# EAGLE design IoT_Shield_V1 (EAGLE 7.6.0)

## Sheet 1 of 2
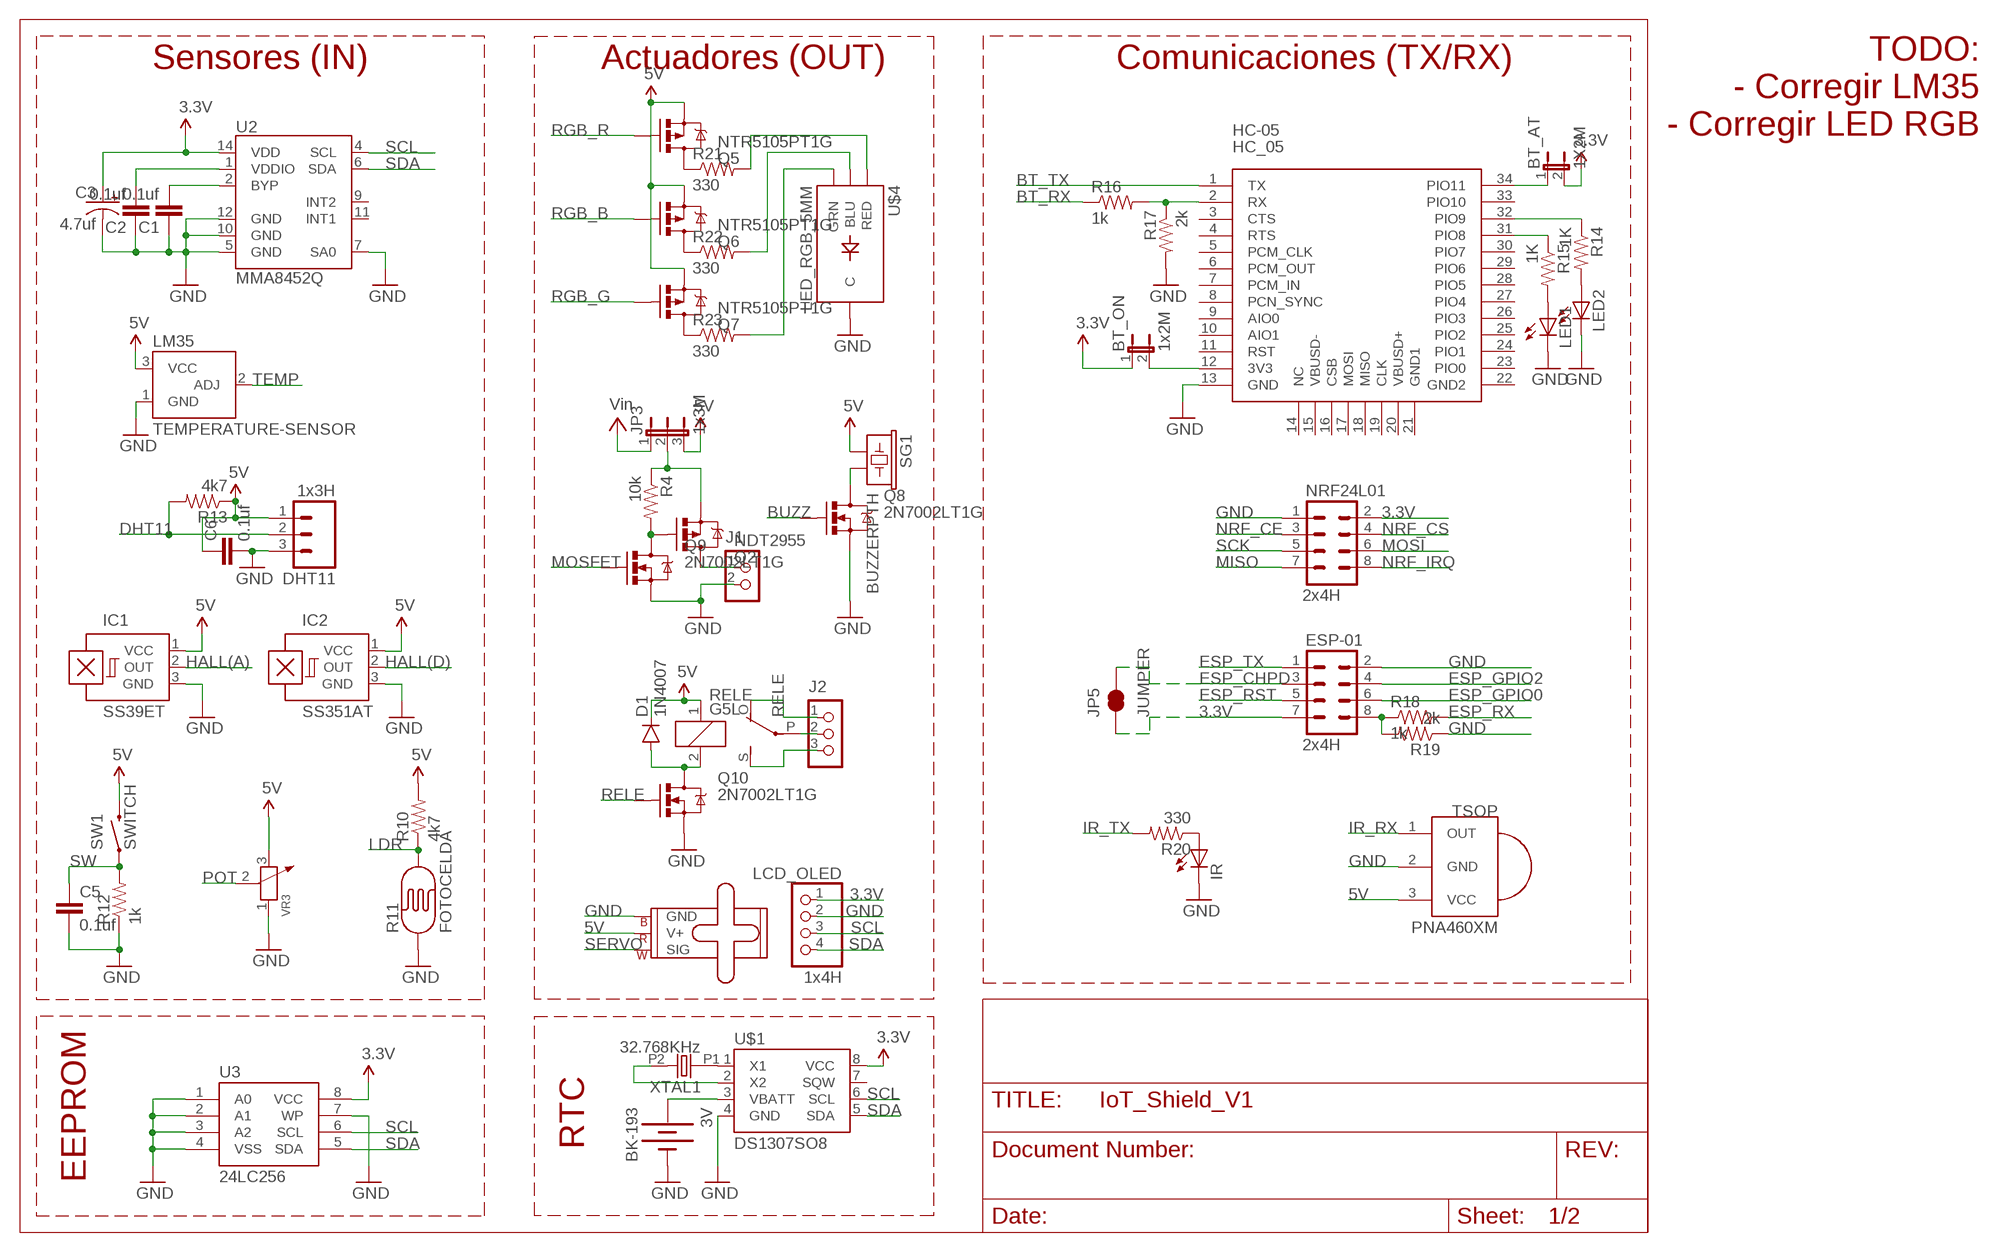
[diagram p0: schematic, sheet 1]

### Parts
3V  BK-193  [BATTERY-20MMTH]
BT_AT  1X2M  JP1E  [JP1]
BT_ON  1x2M  JP1E  [JP1]
C1  0.1uf  CAP0805  [0805]
C2  0.1uf  CAP0805  [0805]
C3  4.7uf  CAP_POL3528-KIT  [EIA3528-KIT]
C5  0.1uf  CAP0805  [0805]
C6  0.1uf  CAP0805  [0805]
D1  1N4007  DIODESMA  [SMA-DIODE]
DHT11  1x3H  M03LOCK  [1X03_LOCK]
ESP-01  2x4H  M04X2  [2X4]
HC-05  HC_05  [BLUETOOTH_SMD]
IC1  SS39ET  A1202LH  [SOT23-W]
IC2  SS351AT  A1202LH  [SOT23-W]
IR  LEDIRL80A  [IRL80A]
J1  CON_TERMINAL_BLOCK_02-5MM  [TERMINAL_BLOCK_2P_5]
J2  CON_TERMINAL_BLOCK_03-5MM  [TERMINAL_BLOCK_3P_5]
JP3  1x3M  JP2E  [JP2]
JP5  JUMPER  JUMPER-PAD-2-NC_BY_TRACENO_SILK  [PAD-JUMPER-2-NC_BY_TRACE_NO_SILK]
LCD_OLED  1x4H  PINHD-1X4  [1X04]
LED1  LEDCHIPLED_0805  [CHIPLED_0805]
LED2  LEDCHIPLED_0805  [CHIPLED_0805]
LM35  TEMPERATURE-SENSOR  [TO-92]
NRF24L01  2x4H  M04X2  [2X4]
Q2  NDT2955  [SOT223]
Q5  NTR5105PT1G  MOSFET-PCHANNEL  [SOT23-3]
Q6  NTR5105PT1G  MOSFET-PCHANNEL  [SOT23-3]
Q7  NTR5105PT1G  MOSFET-PCHANNEL  [SOT23-3]
Q8  2N7002LT1G  MOSFET-NCHANNELAO3404A  [SOT23-3]
Q9  2N7002LT1G  MOSFET-NCHANNELAO3404A  [SOT23-3]
Q10  2N7002LT1G  MOSFET-NCHANNELAO3404A  [SOT23-3]
R4  10k  RESISTOR0805-RES  [0805]
R10  4k7  RESISTOR0805-RES  [0805]
R11  FOTOCELDA  PHOTOCELLPTH  [PHOTOCELL]
R12  1k  RESISTOR0805-RES  [0805]
R13  4k7  RESISTOR0805-RES  [0805]
R14  1K  RESISTOR0805-RES  [0805]
R15  1K  RESISTOR0805-RES  [0805]
R16  1k  RESISTOR0805-RES  [0805]
R17  2k  RESISTOR0805-RES  [0805]
R18  1k  RESISTOR0805-RES  [0805]
R19  2k  RESISTOR0805-RES  [0805]
R20  330  RESISTOR1206  [1206]
R21  330  RESISTOR1206  [1206]
R22  330  RESISTOR1206  [1206]
R23  330  RESISTOR1206  [1206]
RELE  G5L  [G5LE]
SERVO  1X3M  SMALL_SERVO  [1X03]
SG1  BUZZERPTH  [BUZZER-12MM]
SW1  SWITCH  SWITCH-MOMENTARY-2PTH  [TACTILE-PTH]
TSOP  PNA460XM  [PNA460XM]
U2  MMA8452Q  [QFN-16_0.5MM]
U3  24LC256  EEPROM-I2CSMD  [SO08]
U$1  DS1307SO8  [SO08]
U$4  LED_RGB_5MM  LED_PIRANHA_5MM  [LED_PIRANHA_5MM]
VR3  RES-ADJ'WH121-1'  [ADJR2+3P-16.0X12.0X18.0MM]
XTAL1  32.768KHz  OSC-XTALTC-26  [TC-26]

### Nets
3.3V: BT_AT.2 BT_ON.1 C3.A(+) ESP-01.7 JP5.1 LCD_OLED.1 NRF24L01.2 U2.14(VDD) U3.8(VCC) U$1.8(VCC) ; also sheet 2
5V: C6.1 D1.C DHT11.1 IC1.1(VCC) IC2.1(VCC) JP3.3 LM35.3(VCC) Q5.2(S) Q6.2(S) Q7.2(S) R10.2 R13.1 RELE.1 SERVO.2(V+) SG1.+ SW1.3 TSOP.3(VCC) VR3.3 ; also sheet 2
BT_RX: R16.1 ; also sheet 2
BT_TX: HC-05.1(TX) ; also sheet 2
BUZZ: Q8.1(G) ; also sheet 2
DHT11: DHT11.2 R13.2 ; also sheet 2
ESP_CHPD: ESP-01.3 JP5.2 ; also sheet 2
ESP_GPIO0: ESP-01.6 ; also sheet 2
ESP_GPIO2: ESP-01.4 ; also sheet 2
ESP_RST: ESP-01.5 ; also sheet 2
ESP_RX: R18.2 ; also sheet 2
ESP_TX: ESP-01.1 ; also sheet 2
GND: 3V.P1-(-) C1.1 C2.1 C3.C(-) C5.2 C6.2 DHT11.3 ESP-01.2 HC-05.13(GND) IC1.3(GND) IC2.3(GND) IR.K(C) J1.2 LCD_OLED.2 LED1.C LED2.C LM35.1(GND) NRF24L01.1 Q8.2(S) Q9.2(S) Q10.2(S) R11.1 R12.1 R17.2 R19.1 SERVO.3(GND) TSOP.2(GND) U2.5(GND) U2.7(SA0) U2.10(GND) U2.12(GND) U3.1(A0) U3.2(A1) U3.3(A2) U3.4(VSS) U3.7(WP) U$1.4(GND) U$4.-(C) VR3.1 ; also sheet 2
HALL(A): IC1.2(OUT) ; also sheet 2
HALL(D): IC2.2(OUT) ; also sheet 2
IR_RX: TSOP.1(OUT) ; also sheet 2
IR_TX: R20.2 ; also sheet 2
LDR: R10.1 R11.2 ; also sheet 2
MISO: NRF24L01.7 ; also sheet 2
MOSFET: Q9.1(G) ; also sheet 2
MOSI: NRF24L01.6 ; also sheet 2
N$1: U$1.2(X2) XTAL1.P2
N$2: U$1.1(X1) XTAL1.P1
N$3: 3V.P2+(+) 3V.P3+(+) U$1.3(VBATT)
N$4: C1.2 U2.2(BYP)
N$5: C2.2 U2.1(VDDIO)
N$6: J1.1 Q2.2(D) Q2.4(D)
N$8: Q8.3(D) SG1.-
N$9: Q2.1(G) Q9.3(D) R4.2
N$14: D1.A Q10.3(D) RELE.2
N$15: R23.2 U$4.G(GRN)
N$17: R22.2 U$4.B(BLU)
N$18: R21.2 U$4.R(RED)
N$19: JP3.2 Q2.3(S) R4.1
N$21: BT_ON.2 HC-05.12(3V3)
N$22: HC-05.32(PIO9) R14.1
N$23: HC-05.31(PIO8) R15.1
N$24: LED1.A R15.2
N$25: LED2.A R14.2
N$26: HC-05.2(RX) R16.2 R17.1
N$27: ESP-01.8 R18.1 R19.2
N$28: Q5.3(D) R21.1
N$29: BT_AT.1 HC-05.34(PIO11)
N$30: Q6.3(D) R22.1
N$31: Q7.3(D) R23.1
N$44: IR.A R20.1
NRF_CE: NRF24L01.3 ; also sheet 2
NRF_CS: NRF24L01.4 ; also sheet 2
NRF_IRQ: NRF24L01.8
POT: VR3.2 ; also sheet 2
RELE: Q10.1(G) ; also sheet 2
RELE_COMM: J2.2 RELE.P(2:P)
RELE_NC: J2.1 RELE.O(2:O)
RELE_NO: J2.3 RELE.S(2:S)
RGB_B: Q6.1(G) ; also sheet 2
RGB_G: Q7.1(G) ; also sheet 2
RGB_R: Q5.1(G) ; also sheet 2
SCK: NRF24L01.5 ; also sheet 2
SCL: LCD_OLED.3 U2.4(SCL) U3.6(SCL) U$1.6(SCL) ; also sheet 2
SDA: LCD_OLED.4 U2.6(SDA) U3.5(SDA) U$1.5(SDA) ; also sheet 2
SERVO: SERVO.1(SIG) ; also sheet 2
SW: C5.1 R12.2 SW1.1 ; also sheet 2
TEMP: LM35.2(ADJ) ; also sheet 2
VIN: JP3.1 ; supply symbol labelled Vin ; also sheet 2
Unconnected: HC-05.3(CTS) HC-05.4(RTS) HC-05.5(PCM_CLK) HC-05.6(PCM_OUT) HC-05.7(PCM_IN) HC-05.8(PCN_SYNC) HC-05.9(AIO0) HC-05.10(AIO1) HC-05.11(RST) HC-05.14(NC) HC-05.15(VBUSD-) HC-05.16(CSB) HC-05.17(MOSI) HC-05.18(MISO) HC-05.19(CLK) HC-05.20(VBUSD+) HC-05.21(GND1) HC-05.22(GND2) HC-05.23(PIO0) HC-05.24(PIO1) HC-05.25(PIO2) HC-05.26(PIO3) HC-05.27(PIO4) HC-05.28(PIO5) HC-05.29(PIO6) HC-05.30(PIO7) HC-05.33(PIO10) U2.9(INT2) U2.11(INT1) U$1.7(SQW)

### Notes on the sheet
- TODO:
  - Corregir LM35
  - Corregir LED RGB
- Sensores (IN) | Actuadores (OUT) | Comunicaciones (TX/RX)
- RTC
- EEPROM

## Sheet 2 of 2
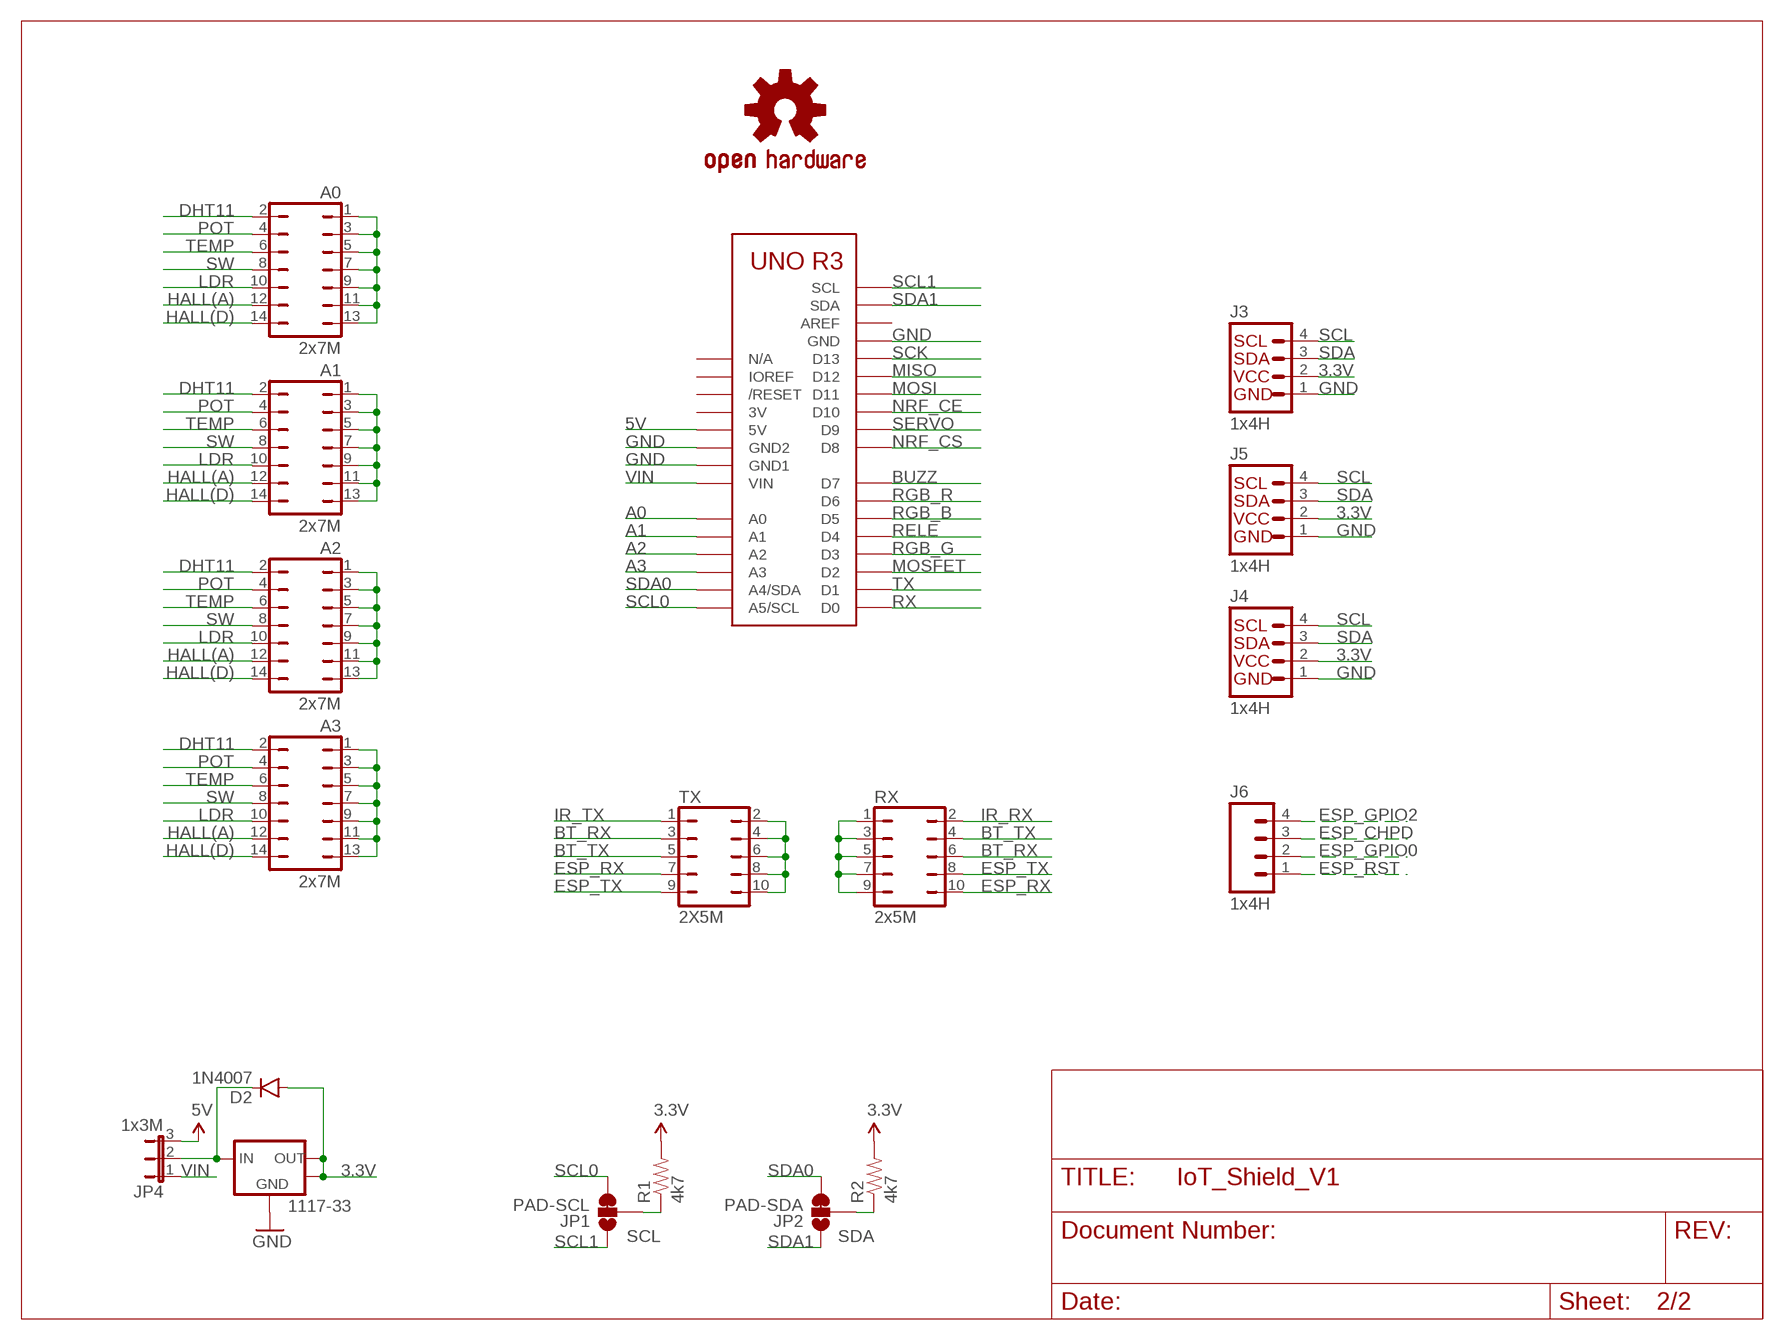
[diagram p1: schematic, sheet 2]

### Parts
1117-33  LV1117-33TO252  [TO252]
A0  2x7M  JP7Q  [JP7Q]
A1  2x7M  JP7Q  [JP7Q]
A2  2x7M  JP7Q  [JP7Q]
A3  2x7M  JP7Q  [JP7Q]
D2  1N4007  DIODESMA  [SMA-DIODE]
J3  1x4H  I2C_STANDARD  [1X04]
J4  1x4H  I2C_STANDARD  [1X04]
J5  1x4H  I2C_STANDARD  [1X04]
J6  1x4H  M04LOCK  [1X04_LOCK]
JP1  PAD-SCL  JUMPER-PAD-3-2OF3_NC_BY_TRACE_LARGE  [PAD-JUMPER-3-2OF3_NC_BY_TRACE_YES_SILK_LARGE]
JP2  PAD-SDA  JUMPER-PAD-3-2OF3_NC_BY_TRACE_LARGE  [PAD-JUMPER-3-2OF3_NC_BY_TRACE_YES_SILK_LARGE]
JP4  1x3M  JP2E  [JP2]
LOGO1  OSHW-LOGOL-COPPER  [OSHW-LOGO-L_COPPER]
R1  4k7  RESISTOR0805-RES  [0805]
R2  4k7  RESISTOR0805-RES  [0805]
RX  2x5M  JP5Q  [JP5Q]
TX  2X5M  JP5Q  [JP5Q]
U1  ARDUINOR3-DIMENSION  [ARDUINOR3]

### Nets
3.3V: 1117-33.2(OUT) 1117-33.4(OUT) D2.A J3.2 J4.2 J5.2 R1.2 R2.2 ; also sheet 1
5V: JP4.3 U1.5V ; also sheet 1
A0: A0.1 A0.3 A0.5 A0.7 A0.9 A0.11 A0.13 U1.A0
A1: A1.1 A1.3 A1.5 A1.7 A1.9 A1.11 A1.13 U1.A1
A2: A2.1 A2.3 A2.5 A2.7 A2.9 A2.11 A2.13 U1.A2
A3: A3.1 A3.3 A3.5 A3.7 A3.9 A3.11 A3.13 U1.A3
BT_RX: RX.6 TX.3 ; also sheet 1
BT_TX: RX.4 TX.5 ; also sheet 1
BUZZ: U1.D7 ; also sheet 1
DHT11: A0.2 A1.2 A2.2 A3.2 ; also sheet 1
ESP_CHPD: J6.3 ; also sheet 1
ESP_GPIO0: J6.2 ; also sheet 1
ESP_GPIO2: J6.4 ; also sheet 1
ESP_RST: J6.1 ; also sheet 1
ESP_RX: RX.10 TX.7 ; also sheet 1
ESP_TX: RX.8 TX.9 ; also sheet 1
GND: 1117-33.1(ADJ) J3.1 J4.1 J5.1 U1.GND U1.GND1 U1.GND2 ; also sheet 1
HALL(A): A0.12 A1.12 A2.12 A3.12 ; also sheet 1
HALL(D): A0.14 A1.14 A2.14 A3.14 ; also sheet 1
IR_RX: RX.2 ; also sheet 1
IR_TX: TX.1 ; also sheet 1
LDR: A0.10 A1.10 A2.10 A3.10 ; also sheet 1
MISO: U1.D12 ; also sheet 1
MOSFET: U1.D2 ; also sheet 1
MOSI: U1.D11 ; also sheet 1
N$20: 1117-33.3(IN) D2.C JP4.2
NRF_CE: U1.D10 ; also sheet 1
NRF_CS: U1.D8 ; also sheet 1
POT: A0.4 A1.4 A2.4 A3.4 ; also sheet 1
RELE: U1.D4 ; also sheet 1
RGB_B: U1.D5 ; also sheet 1
RGB_G: U1.D3 ; also sheet 1
RGB_R: U1.D6 ; also sheet 1
RX: RX.1 RX.3 RX.5 RX.7 RX.9 U1.D0
SCK: U1.D13 ; also sheet 1
SCL: J3.4 J4.4 J5.4 JP1.2 R1.1 ; also sheet 1
SCL0: JP1.3 U1.A5(A5/SCL)
SCL1: JP1.1 U1.SCL
SDA: J3.3 J4.3 J5.3 JP2.2 R2.1 ; also sheet 1
SDA0: JP2.3 U1.A4(A4/SDA)
SDA1: JP2.1 U1.SDA
SERVO: U1.D9 ; also sheet 1
SW: A0.8 A1.8 A2.8 A3.8 ; also sheet 1
TEMP: A0.6 A1.6 A2.6 A3.6 ; also sheet 1
TX: TX.2 TX.4 TX.6 TX.8 TX.10 U1.D1
VIN: JP4.1 U1.VIN ; also sheet 1
Unconnected: U1.AREF U1.IOREF U1.RESERVED(N/A) U1.RESET(/RESET)

## Power pins joined to a net without a drawn wire
3V: U1.3V

## Library data of the parts
3V = diselectronic:BK-193
1117-33 = diselectronic:LV1117-33: Voltage Regulator LM1117 Standard adjustable voltage regulator but in SMD form. Spark Fun Electronics SKU : COM-00595
A0 A1-A3 = jumper:JP7Q: JUMPER
BT_AT BT_ON = jumper:JP1E: JUMPER
C1 C2 = SparkFun-Capacitors:CAP: Capacitor Standard 0603 ceramic capacitor, and 0.1" leaded capacitor.
C3 = SparkFun-Capacitors:CAP_POL: Capacitor Polarized These are standard SMD and PTH capacitors. Normally 10uF, 47uF, and 100uF in electrolytic and tantalum varieties. Always verify the external diameter of the through hole cap, it varies with capacity, voltage, and manufacturer. The EIA devices should be standard.
C5 C6 = SparkFun-Passives:CAP: Capacitor Standard 0603 ceramic capacitor, and 0.1" leaded capacitor.
D1 D2 = SparkFun-DiscreteSemi:DIODE: Diode These are standard reverse protection diodes and small signal diodes. SMA package can handle up to about 1A. SOD-323 can handle about 200mA. What the SOD-323 package when ordering, there are some mfgs out there that are 5-pin packages.
DHT11 = SparkFun-Connectors:M03: Header 3 Standard 3-pin 0.1" header. Use with straight break away headers (SKU : PRT-00116), right angle break away headers (PRT-00553), swiss pins (PRT-00743), machine pins (PRT-00117), and female headers (PRT-00115). Molex polarized connector foot print use with SKU : PRT-08232 with associated crimp pins and housings.
ESP-01 NRF24L01 = SparkFun-Connectors:M04X2: .1" header, two rows of four.
HC-05 = Bluetooth HC-05:HC_05: HC-05 Bluetooth Module
IC1 IC2 = allegro:A12*?: Hall-effect bipolar switch Source: http://www.allegromicro.com/en/Products/Part_Numbers/1202/1202.pdf; OC_FARNELL: unknown; OC_NEWARK: unknown
IR = led:LED: LED
J1 = dp_devices:CON_TERMINAL_BLOCK_02: 2 poles wire to board terminal block
J2 = dp_devices:CON_TERMINAL_BLOCK_03: 3 poles, wire to board connector
J3-J5 = SparkFun-Connectors:I2C_STANDARD: SparkFun has standardized on a pinout for all I2C based sensor breakouts. This pinout allows I2C boards to be plugged directly into the headers on Arduino Uno compatible boards, and to be daisy chained easily.
J6 = SparkFun-Connectors:M04: Header 4 Standard 4-pin 0.1" header. Use with straight break away headers (SKU : PRT-00116), right angle break away headers (PRT-00553), swiss pins (PRT-00743), machine pins (PRT-00117), and female headers (PRT-00115). Molex polarized connector foot print use with SKU : PRT-08231 with associated crimp pins and housings. 1MM SMD Version SKU: PRT-10208; PROD_ID: CONN-09696
JP1 JP2 = SparkFun-Passives:JUMPER-PAD-3-2OF3_NC_BY_TRACE
JP3 JP4 = jumper:JP2E: JUMPER
JP5 = SparkFun-Passives:JUMPER-PAD-2-NC_BY_TRACE
LCD_OLED = pinhead:PINHD-1X4: PIN HEADER
LED1 LED2 = adafruit:LED: LED
LM35 = SparkFun-Sensors:TEMPERATURE-SENSOR: TO-92 temp sensor
LOGO1 = SparkFun-Aesthetics:OSHW-LOGO: Open Source Hardware Logo This logo indicates the piece of hardware it is found on incorporates a OSHW license and/or adheres to the definition of open source hardware found here: http://freedomdefined.org/OSHW
Q2 = diselectronic:NDT2955: MOSFET-PCHANNEL
Q5-Q7 = SparkFun-DiscreteSemi:MOSFET-PCHANNEL: Generic PMOSFET IRLML2244 - TRANS-11153 (SOT-23 -20V -4.3A) (1.Gate 2.Source 3.Drain) FQP27P06 - COM-10349 <http://www.sparkfun.com/products/10349> (TO-220 -60V -27A) (1.Gate 2.Source 3.Drain); PROD_ID: TRANS-08285
Q8-Q10 = SparkFun-DiscreteSemi:MOSFET-NCHANNEL: Common NMOSFET Parts MFG P/N Store ID Prod ID FDD8780 TRANS-09984 SI7820DN TRANS-11055 FDS6630A IC-08089 2N7002PW TRANS-11151 FQP30N06L COM-10213 TRANS-10060 BSS123LT1G TRANS-08345 BSS138 TRANS-00830 BS170 2N7000; PROD_ID: TRAN-12988
R1 R2 R4 R10 R12 R13 R20-R23 = SparkFun-Passives:RESISTOR: Resistor Basic schematic elements and footprints for 0603, 1206, and PTH resistors.
R11 = SparkFun-Sensors:PHOTOCELL: CdS photoresistor. This is a low cost way to detect light levels. Resistance decreases with more incoming light. SparkFun SKU: SEN-09088
R14-R19 = SparkFun-Resistors:RESISTOR: Resistor Basic schematic elements and footprints for 0603, 1206, and PTH resistors.
RELE = relay:G5L: RELAY 1 x switch, 10 A/120 V AC, 8 A/30 V ADC, Omron; OC_FARNELL: unknown; OC_NEWARK: unknown
RX TX = jumper:JP5Q: JUMPER
SERVO = SparkFun-Electromechanical:SMALL_SERVO: Small servo motor This is the small servo used in the SIK. SKU: ROB-09065
SG1 = SparkFun-Electromechanical:BUZZER: Buzzer 12mm Spark Fun Electronics SKU : Comp-Buzzer
SW1 = SparkFun-Electromechanical:SWITCH-MOMENTARY-2: Various NO switches- pushbuttons, reed, etc; PROD_ID: SWCH-08441
TSOP = adafruit:PNA460XM: IR 38KHz receiver PNA4602 and related receivers http://www.ladyada.net/library/pcb/eaglelibrary.html
U1 = trecetp:ARDUINOR3: This is a new object for the new Arduino R3 - with extra pins that you may want to use (such as IOref, and duplicated A4/A5
U2 = SparkFun-Sensors:MMA8452Q: MMA8452Q 3-Axis, 12/8-bit Digital Accelerometer Supply Voltage: 1.6-3.6V Range: +/- 2g, 4g, 8g Interface: I2C, 12-bit and 8-bit ODR: 1.56 Hz - 800 Hz Package: QFN-16 http://cache.freescale.com/files/sensors/doc/data_sheet/MMA8452Q.pdf; PROD_ID: IC-10769
U3 = SparkFun-DigitalIC:EEPROM-I2C: I2C EEPROM chips, 24LC256 (and others)
U$1 = SparkFun-FreqCtrl:DS1307: I2C real-time clock with battery backup.
U$4 = SparkFun-LED:LED_PIRANHA_5MM: High-brightness RGB through-hole LED, similar to that used in the Shiftbrite
VR3 = trecetp:RES-ADJ: Potentiometer
XTAL1 = dp_devices:OSC-XTAL

## Board
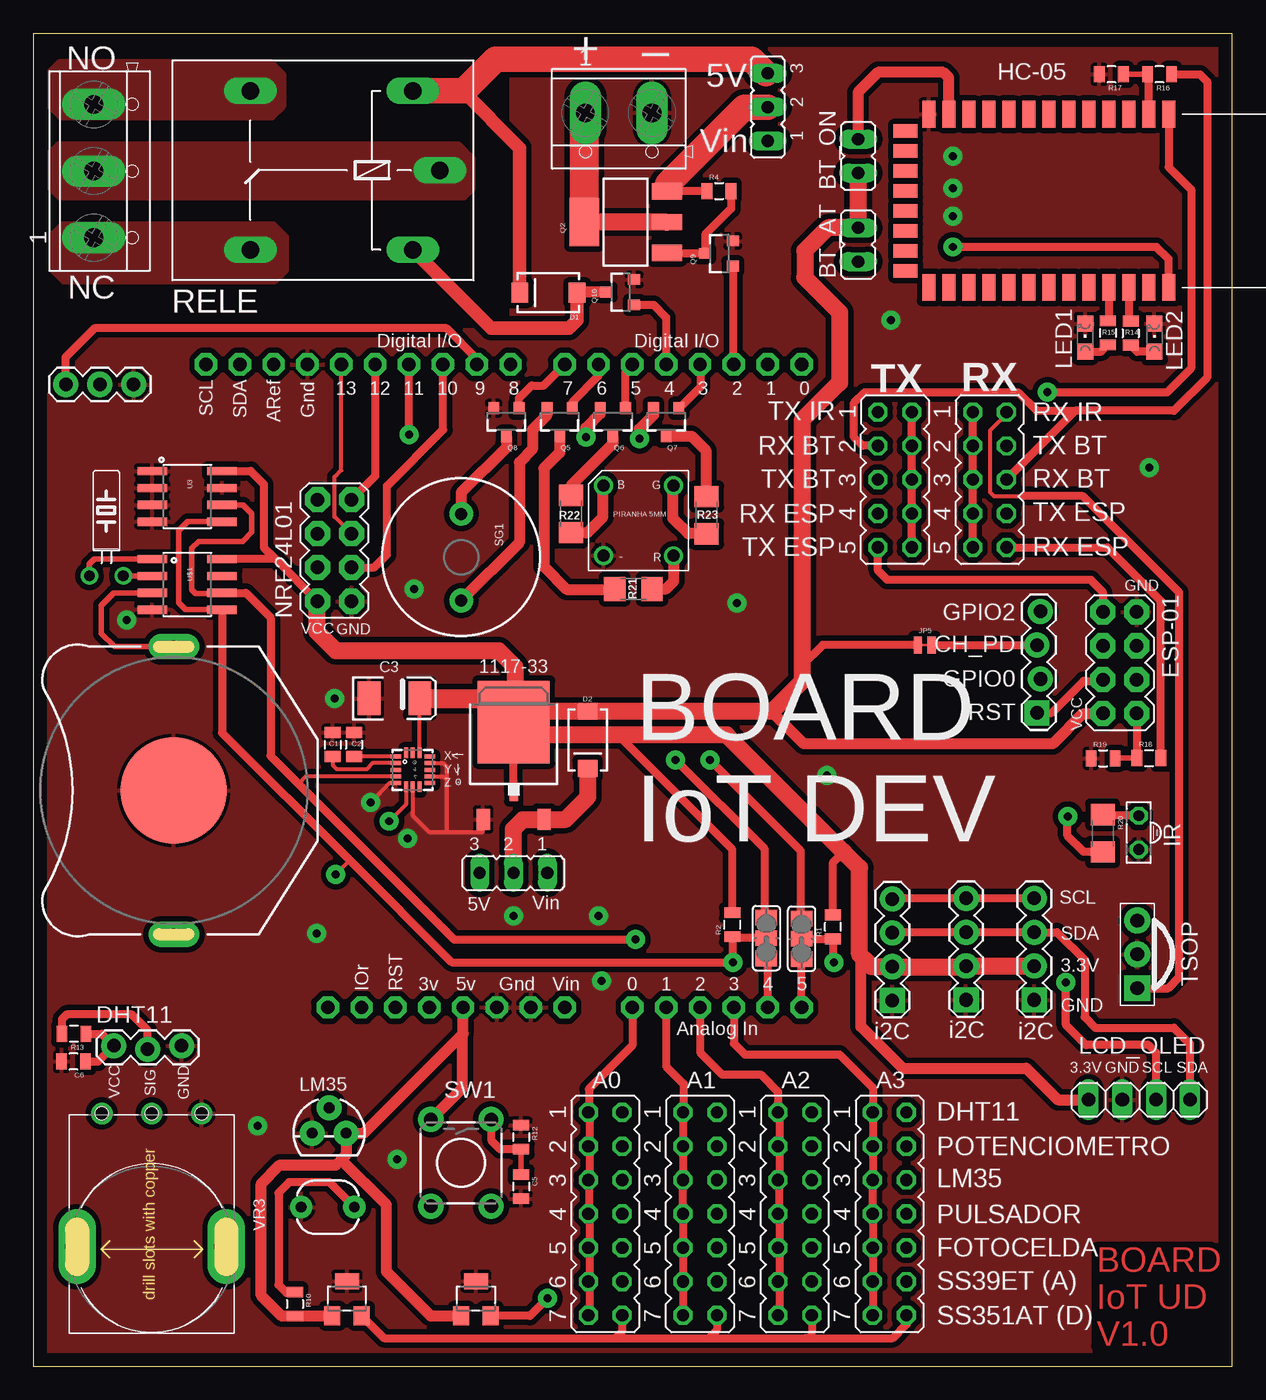
[diagram p2: board, top side]
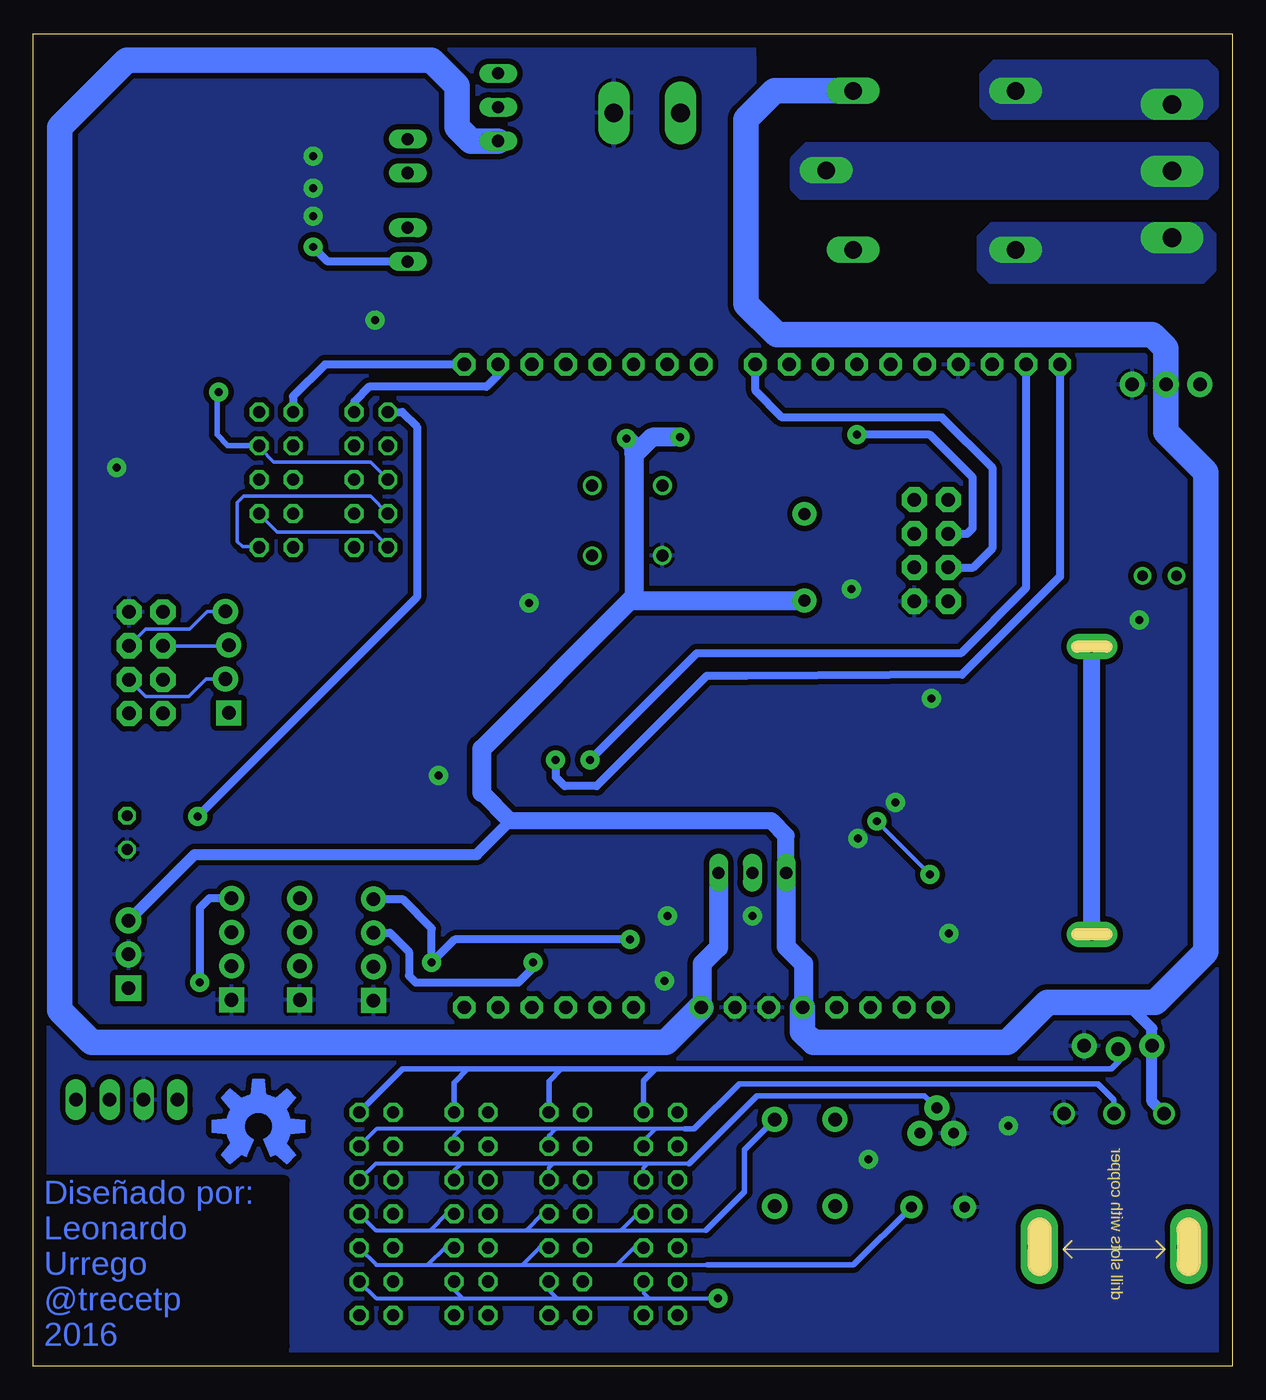
[diagram p3: board, bottom side, seen from below]

Size 90 x 100 mm. Coordinates in mm from the lower left corner, seen from the top.
Outline: 0,0 90,0 90,100 0,100 0,0
Copper layers (1*16): Top 0.035mm / dielectric 1.5mm / Bottom 0.035mm
Design rules "default": minimum track width 10mil, minimum drill 24mil, track to track 8mil, track to pad 8mil, pad to pad 8mil, via to via 8mil, smd to smd 8mil, copper to edge 40mil, drill to drill 8mil, minimum pad ring 10mil, minimum via ring 8mil, stop-mask expansion 4mil, vias tented up to drill 0mil, thermal gap 10mil

### Footprints (pad centres in the part's own frame; a part is rotated, then mirrored left to right if it is on the bottom)
BATTERY-20MMTH = smd 8 x 8: P1- 0,0 | drill 0.9 pad 1.93 long: P2+ -10.8,0; P3+ 10.8,0
TO252 = smd 1 x 1.6: 1 -2.28,-4.8; 3 2.28,-4.8 | smd 0.635 x 1.27: 2 0,-2.794 | smd 5.4 x 6.2: 4 0,2.5
JP7Q = drill 0.914 octagon: 1 -7.62,-1.27; 2 -7.62,1.27; 3 -5.08,-1.27; 4 -5.08,1.27; 5 -2.54,-1.27; 6 -2.54,1.27; 7 0,-1.27; 8 0,1.27; 9 2.54,-1.27; 10 2.54,1.27; 11 5.08,-1.27; 12 5.08,1.27; 13 7.62,-1.27; 14 7.62,1.27
JP1 = drill 0.914 long: 1 0,-1.27; 2 0,1.27
0805 = smd 0.8 x 1.2: 1 -0.9,0; 2 0.9,0
EIA3528-KIT = smd 1.7 x 2.5: A 1.9,0; C -1.9,0
SMA-DIODE = smd 1.27 x 1.47: A -2.15,0; C 2.15,0
1X03_LOCK = drill 1.016 pad 1.88: 1 0,0.127; 2 2.54,-0.127; 3 5.08,0.127
2X4 = drill 1.016 pad 1.88 octagon: 1 -3.81,-1.27; 2 -3.81,1.27; 3 -1.27,-1.27; 4 -1.27,1.27; 5 1.27,-1.27; 6 1.27,1.27; 7 3.81,-1.27; 8 3.81,1.27
BLUETOOTH_SMD = smd 2 x 1: 1 -6.35,3.81; 2 -6.35,2.31; 3 -6.35,0.81; 4 -6.35,-0.69; 5 -6.35,-2.19; 6 -6.35,-3.69; 7 -6.35,-5.19; 8 -6.35,-6.69; 9 -6.35,-8.19; 10 -6.35,-9.69; 11 -6.35,-11.19; 12 -6.35,-12.69; 13 -6.35,-14.19; 22 6.65,-14.19; 23 6.65,-12.69; 24 6.65,-11.19; 25 6.65,-9.69; 26 6.65,-8.19; 27 6.65,-6.69; 28 6.65,-5.19; 29 6.65,-3.69; 30 6.65,-2.19; 31 6.65,-0.69; 32 6.65,0.81; 33 6.65,2.31; 34 6.65,3.81 | smd 1 x 1.8: 14 -5.1,-15.94; 15 -3.6,-15.94; 16 -2.1,-15.94; 17 -0.6,-15.94; 18 0.9,-15.94; 19 2.4,-15.94; 20 3.9,-15.94; 21 5.4,-15.94
SOT23-W = smd 1.2 x 1.4: 1 -1.1,-1.3; 2 1.1,-1.3 | smd 1.8 x 1.2: 3 0,1.3
IRL80A = drill 0.813 octagon: A 0,-1.27; K 0,1.27
TERMINAL_BLOCK_2P_5 = drill 1.4 pad 2.38 long: 1 2.5,-0.45; 2 -2.5,-0.45
TERMINAL_BLOCK_3P_5 = drill 1.4 pad 2.38 long: 1 5,-0.45; 2 0,-0.45; 3 -5,-0.45
1X04 = drill 1.016 pad 1.88 square: 1 0,0 | drill 1.016 pad 1.88: 2 2.54,0; 3 5.08,0; 4 7.62,0
1X04_LOCK = drill 1.016 pad 1.88 square: 1 0,0.127 | drill 1.016 pad 1.88: 2 2.54,-0.127; 3 5.08,0.127; 4 7.62,-0.127
PAD-JUMPER-3-2OF3_NC_BY_TRACE_YES_SILK_LARGE = smd 1.168 x 1.6: 1 -1.524,0; 2 0,0; 3 1.524,0
JP2 = drill 0.914 long: 1 -2.54,0; 2 0,0; 3 2.54,0
PAD-JUMPER-2-NC_BY_TRACE_NO_SILK = smd 0.635 x 1.27: 1 -0.508,0; 2 0.508,0
1X04' = drill 1.016 long: 1 -3.81,0; 2 -1.27,0; 3 1.27,0; 4 3.81,0
CHIPLED_0805 = smd 1.2 x 1.2: A 0,-1.05; C 0,1.05
TO-92 = drill 0.813 pad 1.88: 1 -1.27,0; 2 0,1.905; 3 1.27,0
SOT223 = smd 1.219 x 2.235: 1 -2.311,-3.099; 2 0,-3.099; 3 2.311,-3.099 | smd 3.6 x 2.2: 4 0,3.099
SOT23-3 = smd 0.8 x 0.9: 1 -0.95,-1; 2 0.95,-1; 3 0,1.1
PHOTOCELL = drill 0.8 pad 1.676: 1 -2,0; 2 2,0
1206 = smd 1.6 x 1.8: 1 -1.4,0; 2 1.4,0
G5LE = drill 1.321 long: 1 -7.493,-5.969; 2 -7.493,5.969; O 4.699,5.969; P -9.525,0; S 4.699,-5.969
JP5Q = drill 0.914 octagon: 1 -5.08,-1.27; 2 -5.08,1.27; 3 -2.54,-1.27; 4 -2.54,1.27; 5 0,-1.27; 6 0,1.27; 7 2.54,-1.27; 8 2.54,1.27; 9 5.08,-1.27; 10 5.08,1.27
1X03 = drill 1.016 pad 1.88: 1 0,0; 2 2.54,0; 3 5.08,0
BUZZER-12MM = drill 0.9 pad 1.778: + 3.25,0; - -3.25,0
TACTILE-PTH = drill 1.016 pad 1.88: 1 -3.251,2.261; 2 3.251,2.261; 3 -3.251,-2.261; 4 3.251,-2.261
PNA460XM = drill 1.016 pad 1.93 square: 1 -2.54,0 | drill 1.016 pad 1.93: 2 0,0; 3 2.54,0
ARDUINOR3 = drill 1 pad 1.676 octagon: 3V -6.35,-24.13; 5V -3.81,-24.13; A0 8.89,-24.13; A1 11.43,-24.13; A2 13.97,-24.13; A3 16.51,-24.13; A4 19.05,-24.13; A5 21.59,-24.13; AREF -18.034,24.13; D0 21.59,24.13; D1 19.05,24.13; D2 16.51,24.13; D3 13.97,24.13; D4 11.43,24.13; D5 8.89,24.13; D6 6.35,24.13; D7 3.81,24.13; D8 -0.254,24.13; D9 -2.794,24.13; D10 -5.334,24.13; D11 -7.874,24.13; D12 -10.414,24.13; D13 -12.954,24.13; GND -15.494,24.13; GND1 1.27,-24.13; GND2 -1.27,-24.13; IOREF -11.43,-24.13; RESERVED -13.97,-24.13; RESET -8.89,-24.13; SCL -23.114,24.13; SDA -20.574,24.13; VIN 3.81,-24.13
QFN-16_0.5MM = smd 0.8 x 0.3: 1 -1.275,1; 2 -1.275,0.5; 3 -1.275,0; 4 -1.275,-0.5; 5 -1.275,-1; 9 1.275,-1; 10 1.275,-0.5; 11 1.275,0; 12 1.275,0.5; 13 1.275,1 | smd 0.3 x 0.8: 6 -0.5,-1.275; 7 0,-1.275; 8 0.5,-1.275; 14 0.5,1.275; 15 0,1.275; 16 -0.5,1.275
SO08 = smd 0.61 x 2.21: 1 -1.905,-2.616; 2 -0.635,-2.616; 3 0.635,-2.616; 4 1.905,-2.616; 5 1.905,2.616; 6 0.635,2.616; 7 -0.635,2.616; 8 -1.905,2.616
LED_PIRANHA_5MM = drill 0.9: - -2.684,-2.684; B -2.688,2.574; G 2.575,2.562; R 2.579,-2.696
ADJR2+3P-16.0X12.0X18.0MM = drill 1 pad 1.6: 1 -8.3,3.75; 2 -8.3,0; 3 -8.3,-3.75 | drill 1.8 pad 2.8 long: P1 1.7,5.6; P2 1.7,-5.6
TC-26 = drill 0.8: P1 -1.27,-2.54; P2 1.27,-2.54

### Placement (x,y rotation side)
3V  10.55,43.21 90 top
1117-33  36.05,45.84 0 top
A0  42.93,11.43 270 top
A1  50.04,11.43 270 top
A2  57.15,11.43 270 top
A3  64.26,11.43 270 top
BT_AT  61.9,84.17 0 top
BT_ON  61.9,90.82 0 top
C1  22.48,46.65 270 top
C2  24.08,46.65 270 top
C3  27.11,50.12 0 top
C5  36.61,13.47 270 top
C6  3.02,22.86 180 top
D1  38.66,80.57 180 top
D2  41.6,47 270 top
DHT11  6.04,23.91 0 top
ESP-01  81.54,52.8 270 top
HC-05  81.4,87.61 270 top
IC1  33.21,5.08 0 top
IC2  23.53,5.08 0 top
IR  82.97,40.04 180 top
J1  43.93,93.61 180 top
J2  4.98,89.69 270 top
J3  75.13,27.49 90 top
J4  64.47,27.44 90 top
J5  70.01,27.49 90 top
J6  75.45,49.03 90 top
JP1  57.66,32.07 270 top
JP2  55.01,32.13 270 top
JP3  55.12,94.49 90 top
JP4  36.04,37.03 180 top
JP5  66.9,54.13 0 top
LCD_OLED  1x4H  [1X04']  83,20 0 top
LED1  78.95,77.21 0 top
LED2  84.15,77.18 0 top
LM35  22.2,17.49 0 top
LOGO1  73.1,18 0 bottom
NRF24L01  22.61,61.21 90 top
Q2  44.45,85.85 90 top
Q5  39.5,70.9 180 top
Q6  43.5,70.9 180 top
Q7  47.5,70.9 180 top
Q8  35.5,70.9 180 top
Q9  51.5,83.5 90 top
Q10  44.1,80.6 90 top
R1  60.01,32.97 90 top
R2  52.46,33.12 90 top
R4  51.46,88.19 0 top
R10  19.64,4.66 270 top
R11  22.1,11.94 0 top
R12  36.62,17.19 270 top
R13  3.04,24.94 180 top
R14  82.35,77.53 270 top
R15  80.65,77.55 270 top
R16  84.52,96.94 180 top
R17  80.91,96.95 180 top
R18  83.72,45.63 0 top
R19  80.29,45.61 0 top
R20  80.26,40 270 top
R21  45.04,58.34 0 top
R22  40.35,63.96 270 top
R23  50.52,63.87 270 top
RELE  20.98,89.75 180 top
RX  71.77,66.53 270 top
SERVO  2.45,73.68 0 top
SG1  32.12,60.71 270 top
SW1  32.1,15.26 270 top
TSOP  82.86,30.91 90 top
TX  64.66,66.53 270 top
U1  36.07,51.05 0 top
U2  28.47,44.75 0 top
U3  11.55,65.28 270 top
U$1  11.55,58.67 270 top
U$4  45.48,63.52 0 top
VR3  8.89,10.67 270 top
XTAL1  5.48,61.85 0 top

### Tracks (layer width: path | path; a pad name or v marks a point on that pad's centre or on a via)
3.3V
  Top 0.254: 14.35,60.75 U$1.8
  Top 0.305: U2.14 28.97,50.08 C3.A
  Top 0.406: 80.23,48.94 ESP-01.7
  Top 0.61: U3.8 16.32,67.18 17.3,66.2 17.3,61.45 18.17,60.58 | 18.17,60.58 U$1.8 | 1117-33.2 1117-33.4 | R1.2 60.01,37.81 60.8,38.6 | 18.17,60.58 18.17,60.57 NRF24L01.2 | JP5.1 59.25,54.13 57.7,52.58 | R2.2 52.46,38.77 43.87,47.37
  Top 0.813: 36,48 36.1,47.9 | 80.23,48.94 78.74,48.94 76.5,46.71 57.84,46.71 55.4,49.15 | 62.35,30.55 62.1,30.3 62.1,25.5 65.25,22.35 74.52,22.35 76.88,20 LCD_OLED.1
  Top 1.27: J3.2 J5.2 69.96,29.98 J4.2 62.92,29.98 62.35,30.55 62,30.9 62,37.4 60.8,38.6 52.03,47.37 43.87,47.37 37.01,47.37 1117-33.4 36.1,47.43 36.1,47.9 36.1,49 36.25,49.15 | BT_ON.1 BT_AT.2 59.64,85.44 57.9,83.7 57.9,81.7 60.5,79.1 60.5,73.8 57.7,71 57.7,52.58 57.7,51.4 55.45,49.15 55.4,49.15 D2.A 36.25,49.15 | NRF24L01.2 21.3,57.37 21.3,55.1 22.7,53.7 34.92,53.7 36.14,52.48 36.14,49.26 36.25,49.15
  Top 1.422: 36.2,48 36.1,47.9 | C3.A 34.27,50.12 1117-33.4
5V  (via drill 0.6 pad 1.42)
  Top 0.254: 55,97 JP3.3
  Top 0.61: 38.55,71.85 Q5.2 | C6.1 4.86,22.86 DHT11.1 5.14,24.94 R13.1
  Top 0.813: 32.2,24.9 24.79,17.49 LM35.3 23.5,17.46 23.5,15.9 23.1,15.5 | 32.2,24.9 32.26,24.96 U1.5V | 23.1,15.5 22.7,15.1 18.5,15.1 17.1,13.7 17.1,5.3 18.64,3.76 R10.2 22.41,3.76 IC2.1 | 23.1,15.5 26.5,12.1 26.5,7.1 29.82,3.78 IC1.1 | SW1.3 32.2,20.88 32.2,24.9 | Q7.2 46.55,71.39 45.49,70.33 v45.49,69.62 | Q6.2 42.55,71.48 41.48,70.41 v41.48,69.72 | 38.55,71.85 38.55,71.37 37.47,70.28 37.47,68.81 36.47,67.82 36.47,61.82 SG1.+
  Top 1.016: D1.C 36.51,91.41 32.2,95.72
  Top 1.93: 55,97 53.9,98.1 34.7,98.1 32.31,95.72 32.2,95.72 RELE.1
  Bottom 0.813: 8,27.3 6.04,25.34 DHT11.1 6.04,19.87 VR3.3 | TSOP.3 77.9,38.4 56.72,38.4 54.2,40.92
  Bottom 1.27: JP4.3 33.5,39.8 34.62,40.92 54.2,40.92 56.34,43.05
  Bottom 1.422: JP4.3 33.5,31.5 32.2,30.2 32.2,26.98 U1.5V | 56.34,43.05 56.34,46.33 45.2,57.46 44.91,57.46 | 44.91,57.46 SG1.+ | 44.91,68.38 44.91,57.46 | v41.48,69.72 43.56,69.72 44.91,68.38 | 44.91,68.38 44.91,69.04 v45.49,69.62
  Bottom 1.93: U1.5V 32.26,25.1 31.46,24.3 16.9,24.3 13.9,27.3 8,27.3 5.8,27.3 2,31.1 2,67.1 4.99,70.09 SERVO.2 4.99,76.39 6,77.4 34.2,77.4 36.5,79.7 36.5,93.6 34.38,95.72 RELE.1
A0
  Top 0.254: 41.75,4 A0.13 | 41.75,6.25 A0.11 41.75,6.5 | 41.75,9 A0.9 41.75,8.75 | 41.75,11.25 A0.7 41.75,11.5 | 41.75,13.75 A0.5 41.75,14 | 41.75,16.75 A0.3 41.75,16.5 | 41.75,19 A0.1
  Top 0.61: 41.75,6.25 41.75,4 | 41.75,11.25 41.75,9 | 41.75,11.5 41.75,13.75 | 41.75,8.75 41.75,6.5 | 41.75,19 41.75,16.75 | 41.75,16.5 41.75,14 | U1.A0 44.96,24.06 41.7,20.8 41.7,19.09 A0.1
A1
  Top 0.254: 48.75,4 A1.13 | 48.75,6.25 A1.11 48.75,6.5 | 48.75,9 A1.9 48.75,8.75 | 48.75,11.25 A1.7 48.75,11.5 | 48.75,13.75 A1.5 48.75,14 | 48.75,16.75 A1.3 48.75,16.5 | 48.75,19 A1.1
  Top 0.61: 48.75,6.25 48.75,4 | 48.75,11.25 48.75,9 | 48.75,11.5 48.75,13.75 | 48.75,8.75 48.75,6.5 | 48.75,19 48.75,16.75 | 48.75,16.5 48.75,14 | U1.A1 47.5,22.5 48.8,21.2 48.8,19.08 A1.1
A2
  Top 0.254: 56,4 A2.13 | 56,6.25 A2.11 56,6.5 | 56,9 A2.9 56,8.75 | 56,11.25 A2.7 56,11.5 | 56,13.75 A2.5 56,14 | 56,16.75 A2.3 56,16.5 | 56,19 A2.1
  Top 0.61: 56,6.25 56,4 | 56,11.25 56,9 | 56,11.5 56,13.75 | 56,8.75 56,6.5 | 56,19 56,16.75 | 56,16.5 56,14 | U1.A2 50.04,23.56 51.7,21.9 54.6,21.9 55.9,20.6 55.9,19.07 A2.1
A3
  Top 0.254: 63,4 A3.13 | 63,6.25 A3.11 63,6.5 | 63,9 A3.9 63,8.75 | 63,11.25 A3.7 63,11.5 | 63,13.75 A3.5 63,14 | 63,16.75 A3.3 | 63,19 A3.1
  Top 0.61: 63,6.25 63,4 | 63,11.25 63,9 | 63,11.5 63,13.75 | 63,8.75 63,6.5 | 63,19 63,16.75 | A3.3 63,14 | U1.A3 52.58,24.22 53.4,23.4 60.5,23.4 63,20.9 A3.1
BT_RX
  Top 0.254: 72.95,66.6 RX.6
  Top 0.61: TX.3 62.23,69.07 61.6,69.7 61.6,72.3 62.4,73.1 73.9,73.1 75.3,71.7 78.21,71.7 | R16.1 87.56,96.94 88.1,96.4 88.1,74.2 85.6,71.7 78.3,71.7 78.21,71.7 | 78.21,71.7 RX.6
BT_TX  (via drill 0.61 pad 1.42)
  Top 0.61: HC-05.1 85.21,89.99 86.9,88.3 86.9,74.9 85.1,73.1 v76.1,73.1
  Bottom 0.254: 73.2,69.1 RX.4 72.95,68.85 71.95,67.85 64.7,67.85 63.45,66.6 TX.5
  Bottom 0.406: 73.2,69.1 75.4,69.1 76.2,69.9 76.2,73 v76.1,73.1
BUZZ
  Top 0.61: Q8.1 36.45,72.65 37.4,73.6 38.29,73.6 U1.D7
DHT11
  Top 0.61: DHT11.2 8.58,25.22 7.4,26.4 2.5,26.4 2.14,26.04 R13.2
  Bottom 0.406: A3.2 62.28,22.3 57.4,22.3 | 57.4,22.3 50.4,22.3 | 50.4,22.3 43.3,22.3 | 43.3,22.3 9.1,22.3 8.5,22.9 8.5,23.7 DHT11.2 | A2.2 58.42,21.28 57.4,22.3 | A1.2 51.31,21.39 50.4,22.3 | A0.2 44.2,21.4 43.3,22.3
ESP_CHPD
  Top 0.61: JP5.2 75.33,54.13 J6.3
  Bottom 0.254: J6.3 75.37,54.07 ESP-01.3
ESP_GPIO0
  Bottom 0.254: ESP-01.6 81.56,50.28 78.33,50.28 77.04,51.57 J6.2
ESP_GPIO2
  Bottom 0.254: ESP-01.4 81.55,55.33 78.28,55.33 76.96,56.65 J6.4
ESP_RST
  Top 0.61: J6.1 76.43,49.03 78.83,51.43 80.17,51.43 ESP-01.5
ESP_RX
  Top 0.305: RX.10 73.1,61.45
  Top 0.406: 73.1,61.4 RX.10
  Top 0.61: R18.2 84.62,57.44 80.61,61.45 RX.10 73.1,61.4
  Bottom 0.254: TX.7 64.7,65.3 74.2,65.3 74.7,64.8 74.7,61.9 74.3,61.5 73.09,61.5 RX.10
ESP_TX
  Top 0.61: TX.9 63.4,59.7 64.1,59 79.38,59 80.26,58.12 ESP-01.1
  Bottom 0.254: RX.8 72.95,63.85 71.7,62.6 64.45,62.6 63.45,61.6 TX.9
GND  (via drill 0.6 pad 1.42)
  Top 0.305: U2.7 28.47,41.33 29.7,40.1 30.9,40.1 | 30.9,40.1 33.74,40.1 1117-33.1 | U2.10 30.75,44.25 31,44 | 31,44 31,40.2 30.9,40.1 | U2.12 30.75,45.25 31,45 31,44 | U2.5 26.75,43.75 v25.3,42.3
  Top 0.406: 67.2,93.97 HC-05.13
  other vias: 22.6,50.1 28.1,39.6 69,90.8 69,88.4 69,86.3 7,56 64.35,78.51 83.76,67.43 52.79,57.27 59.58,44.32 21.27,32.48 27.32,15.54 16.83,18.03 28.59,58.34 42.63,28.9 36.03,33.78 42.41,33.8
  pour Bottom (isolate 0.406): -0.3,-0.3 90.4,-0.3 90.4,100.2 35.9,100.2 35.7,77.8 -0.3,77.8
  pour Top (isolate 0.406): -0.6,-0.7 -0.6,77.8 35.9,77.8 35.9,100.2 90.5,100.2 90.5,-0.7
HALL(A)  (via drill 0.6 pad 1.42)
  Top 0.61: v38.6,5.1 37.28,3.78 IC1.2
  Bottom 0.305: A3.12 64.28,5.1 57.8,5.1 | 57.8,5.1 50.7,5.1 | 50.7,5.1 43.8,5.1 | 43.8,5.1 v38.6,5.1 | A2.12 58.42,5.72 57.8,5.1 | A1.12 51.31,5.71 50.7,5.1 | A0.12 44.2,5.5 43.8,5.1
HALL(D)
  Top 0.254: 44,3.75 A0.14 | 51.25,3.75 A1.14
  Top 0.305: 65.53,3.13 A3.14 | 58.42,2.52 58,2.1
  Top 0.61: IC2.2 26.31,2.1 43.7,2.1 | 43.7,2.1 50.7,2.1 | 50.7,2.1 58,2.1 64.5,2.1 65.53,3.13 | A2.14 58.42,2.52 | A1.14 51.31,2.71 50.7,2.1 | A0.14 44.2,2.6 43.7,2.1
IR_RX
  Top 0.254: 73.2,71.6 RX.2
  Top 0.305: 73.2,71.6 71.8,70.2 71.8,65.6 72.1,65.3 74.25,65.3
  Top 0.61: TSOP.1 85.17,28.37 86,29.2 86,58.07 78.77,65.3 74.25,65.3
IR_TX  (via drill 0.6 pad 1.42)
  Top 0.61: R20.2 78.83,38.59 77.62,39.8 77.62,41.24 v77.65,41.27
  Bottom 0.61: TX.1 62.31,71.61 61.2,70.5 61.2,57.72 v77.65,41.27
LDR
  Top 0.406: 19.58,5.5 R10.1
  Top 0.61: R11.2 22.24,13.8 19.2,13.8 18.4,13 18.4,6.1 19,5.5 19.58,5.5
  Bottom 0.305: A3.10 64.24,7.6 60.4,7.6 | 60.4,7.6 53.3,7.6 | 53.3,7.6 46.2,7.6 | 46.2,7.6 39.4,7.6 | A0.10 44.91,8.89 46.2,7.6 | A1.10 52.01,8.89 53.3,7.6 | A2.10 59.11,8.89 60.4,7.6
  Bottom 0.406: 39.4,7.6 28.44,7.6 R11.2
MISO
  Top 0.61: U1.D12 25.65,66.8 NRF24L01.7
MOSFET
  Top 0.61: Q9.1 52.5,75.26 U1.D2
MOSI  (via drill 0.6 pad 1.42)
  Top 0.406: v28.2,69.9 v28.19,69.91
  Top 0.61: v28.19,69.91 U1.D11
  Bottom 0.61: v28.2,69.9 22.7,69.9 19.5,66.7 19.5,62.9 19.92,62.48 NRF24L01.6
N$1
  Top 0.406: U$1.2 XTAL1.P2
N$2
  Top 0.406: U$1.1 4.58,60.58 4.2,60.2 4.2,59.32 XTAL1.P1
N$3
  Top 0.406: U$1.3 6.04,58.04 5.1,57.1 5.1,55 6.09,54.01 3V.P3+
  Bottom 1.27: 3V.P2+ 3V.P3+
N$4
  Top 0.305: U2.2 25.45,45.25 25,44.8 22.8,44.8 22.5,45.1 22.5,45.74 C1.2
N$5
  Top 0.305: U2.1 C2.2
N$6
  Top 1.27: Q2.2 Q2.4
  Top 2.184: Q2.4 41.35,94.28 J1.1
N$8
  Top 0.813: Q8.3 35.5,68.95 32.12,65.57 SG1.-
N$9
  Top 0.61: Q2.1 50.4,83.54 Q9.3 50.42,83.52 50.42,84.91 52.36,86.86 R4.2
N$14
  Top 0.813: Q10.3 40.84,80.6 D1.A
  Top 1.016: D1.A 40.81,78.51 40.2,77.9 34.35,77.9 RELE.2
N$15
  Top 0.813: R23.2 49.16,62.47 48.01,63.63 48.01,66.04 U$4.G
N$17
  Top 0.813: R22.2 41.58,62.56 42.75,63.73 42.75,66.06 U$4.B
N$18
  Top 0.813: R21.2 47.49,58.34 48.08,58.93 48.08,60.8 U$4.R
N$19
  Top 0.254: 50.75,88.25 R4.1
  Top 0.61: R4.1 47.58,88.19 Q2.3
  Top 1.27: 47.6,88.7 47.6,88.22 Q2.3
  Top 1.93: JP3.2 55.11,94.5 53.35,94.5 47.58,88.72 47.6,88.7
N$20
  Top 1.27: JP4.2 36.04,40.3 36.75,41.02 38.31,41.02 1117-33.3 39.95,41.04 41.63,42.72 41.63,44.82 D2.C
N$21
  Top 0.813: HC-05.12 68.71,96.69 68.3,97.1 63.4,97.1 61.9,95.6 BT_ON.2
N$22
  Top 0.61: HC-05.32 82.21,78.57 R14.1
N$23
  Top 0.61: HC-05.31 80.71,78.52 R15.1
N$24
  Top 0.61: LED1.A 80.16,76.16 R15.2
N$25
  Top 0.61: LED2.A 82.85,76.13 R14.2
N$26
  Top 0.406: 83.71,96.85 R16.2 R17.1
  Top 0.61: HC-05.2 83.71,96.85
N$27
  Top 0.406: ESP-01.8 82.82,48.98 | R18.1 81.21,45.63 R19.2
  Top 0.61: 82.82,48.98 R18.1
N$28
  Top 0.813: Q5.3 39.5,68.56 38.33,67.39 38.33,59.99 40.03,58.29 43.59,58.29 R21.1
N$29  (via drill 0.6 pad 1.42)
  Top 0.61: HC-05.34 85.21,83.09 84.3,84 v69,84
  Bottom 0.61: BT_AT.1 67.9,82.9 v69,84
N$30
  Top 0.813: Q6.3 43.5,69.23 40.36,66.09 40.36,65.38 R22.1
N$31
  Top 0.813: Q7.3 49.4,69.8 50.47,68.73 50.47,65.32 R23.1
N$44
  Top 0.61: IR.A 80.34,41.31 R20.1
NRF_CE
  Top 0.61: NRF24L01.3 25.58,59.94 26.54,60.91 26.54,66.06 30.76,70.28 30.76,75.16 U1.D10
NRF_CS
  Bottom 0.61: NRF24L01.4 19.46,59.94 18,61.4 18,67.4 21.8,71.2 33.8,71.2 35.8,73.2 U1.D8
POT
  Bottom 0.254: 44,16.5 A0.4
  Bottom 0.305: 41.1,17.8 43.3,17.8 | 43.3,17.8 50.8,17.8 | 50.8,17.8 57.9,17.8 | 57.9,17.8 64.24,17.8 A3.4 | A2.4 58.42,17.28 57.9,17.8 | A1.4 51.31,17.29 50.8,17.8 | 44,16.5 44,17.1 43.3,17.8
  Bottom 0.406: VR3.2 8.89,19.99 10.1,21.2 37,21.2 40.4,17.8 41.1,17.8
RELE
  Top 0.61: Q10.1 46.55,79.65 47.5,78.7 U1.D4
RELE_COMM
  pour Bottom (no thermals): 2,87.8 32.3,87.8 32.9,88.4 32.9,90.6 31.9,91.6 1.9,91.6 1.3,91 1.3,88.5
  pour Top (no thermals): 2,87.8 32.3,87.8 32.9,88.4 32.9,90.6 31.9,91.6 1.9,91.6 1.3,91 1.3,88.5
RELE_NC
  pour Bottom (no thermals): 2.3,81.5 18.1,81.5 18.9,82.3 18.9,84.7 18,85.6 2.2,85.6 1.5,84.9 1.5,82.3
  pour Top (no thermals): 2.3,81.5 18.1,81.5 18.9,82.3 18.9,84.7 18,85.6 2.2,85.6 1.5,84.9 1.5,82.3
RELE_NO
  pour Bottom (no thermals): 2.1,93.8 17.9,93.8 18.7,94.6 18.7,96.9 17.8,97.8 2,97.8 1.3,97.1 1.3,94.6
  pour Top (no thermals): 2.1,93.8 17.9,93.8 18.7,94.6 18.7,96.9 17.8,97.8 2,97.8 1.3,97.1 1.3,94.6
RGB_B
  Top 0.61: Q6.1 44.45,74.68 U1.D5
RGB_G
  Top 0.406: Q7.1 48.5,71.9 | 50.1,75.12 U1.D3
  Top 0.61: 48.5,71.9 50.1,73.5 50.1,75.12
RGB_R
  Top 0.61: Q5.1 40.45,72.35 42.4,74.3 42.4,75.17 U1.D6
RX
  Top 0.61: RX.9 RX.7 RX.5 RX.3 RX.1
  Bottom 0.406: RX.1
  Bottom 0.61: U1.D0 68.12,75.18 70.5,72.8 RX.1
SCK
  Top 0.305: NRF24L01.5 22.61,63.75 22.61,66.74 23.11,67.24 U1.D13
SCL  (via drill 0.6 pad 1.42)
  Top 0.305: U2.4 20.45,44.25 19.9,43.7
  Top 0.406: U3.6 15.76,64.64 16.4,64 16.4,62.6 15.7,61.9 12.4,61.9 11.9,61.4 11.9,58.3 12.2,58 14.13,58 U$1.6
  Top 0.61: JP1.2 R1.1 60.01,30.39 v60.1,30.3 | J3.4 J5.4 64.52,35.11 | U$1.6 15.96,58.04 17.8,56.2 17.8,45.8 19.9,43.7 31.58,32.02 v45.2,32.02 | LCD_OLED.3 84.27,23.53 83.7,24.1 79,24.1 77.5,25.6 v77.5,28.8
  Top 1.27: 64.52,35.11 J4.4
  Bottom 0.61: J3.4 76.79,35.11 77.5,34.4 v77.5,28.8 | J4.4 62.3,35.05 60.1,32.85 v60.1,30.3 58.38,32.02 v45.2,32.02
SCL0
  Top 0.61: U1.A5 JP1.3
SCL1  (via drill 0.6 pad 1.42)
  Top 0.406: 57.6,33.66 JP1.1
  Top 0.61: 57.6,33.66 57.6,38.67 v50.79,45.48
  Bottom 0.61: U1.SCL 12.95,59.25 20.3,51.9 36.5,51.8 39.46,51.8 47.73,43.54 50.11,43.54 50.77,44.2 50.77,45.47 v50.79,45.48
SDA  (via drill 0.6 pad 1.42)
  Top 0.254: 14.1,63.25 U3.5
  Top 0.305: U2.6 27.97,42.17 v26.7,40.9 | v22.7,36.9 23.7,37.9 23.8,37.9
  Top 0.406: U$1.5 11.43,56.77 10.9,57.3 10.9,62.7 11.6,63.4 14.14,63.4 U3.5 | J3.3 75.23,32.57
  Top 0.61: U$1.5 14.17,47.53 23.8,37.9 31.39,30.31 v52.5,30.31 52.5,32.19 R2.1 52.56,32.13 JP2.2 | J3.3 J5.3 64.52,32.57 | LCD_OLED.4 86.8,24.2 85.6,25.4 79.7,25.4 78.9,26.2 78.9,30.5 76.83,32.57 75.23,32.57
  Top 1.27: 64.52,32.57 J4.3
  Bottom 0.305: v26.7,40.9 v22.7,36.9
  Bottom 0.61: J4.3 63.22,32.52 61.8,31.1 61.8,29.3 61.3,28.8 53.6,28.8 52.5,29.9 v52.5,30.31
SDA0
  Top 0.61: U1.A4 55.12,30.6 JP2.3
SDA1  (via drill 0.6 pad 1.42)
  Top 0.406: 54.9,33.76 JP2.1
  Top 0.61: 54.9,33.76 54.9,38.82 v48.21,45.51
  Bottom 0.61: U1.SDA 15.49,58.41 20.4,53.5 40.22,53.5 v48.21,45.51
SERVO
  Top 0.61: U1.D9 33.27,75.63 31,77.9 4.6,77.9 2.4,75.7 2.4,73.73 SERVO.1
SW
  Top 0.406: C5.1 36.61,16.28 R12.2 | 34.4,18.47 SW1.1
  Top 0.61: R12.2 35.01,16.29 34.4,16.9 34.4,18.47
  Bottom 0.305: A3.8 64.3,10.2 60.2,10.2 | 60.2,10.2 53,10.2 | 53,10.2 45.9,10.2 | 45.9,10.2 39.5,10.2 | A0.8 44.67,11.43 45.9,10.2 | A1.8 51.77,11.43 53,10.2 | A2.8 58.97,11.43 60.2,10.2
  Bottom 0.406: 39.5,10.2 36.62,13.08 R12.2 36.58,16.29 SW1.1
TEMP
  Bottom 0.305: 40.8,15.2 43.9,15.2 | 43.9,15.2 51,15.2 | 51,15.2 57.9,15.2 | 57.9,15.2 64.3,15.2 A3.6 | A2.6 58.42,14.68 57.9,15.2 | A1.6 51.31,14.89 51,15.2 | A0.6 44.2,14.9 43.9,15.2
  Bottom 0.406: LM35.2 23.11,20.3 35.7,20.3 40.8,15.2
TX
  Top 0.254: 65.95,66.6 TX.6 | 65.95,68.85 TX.4
  Top 0.406: 65.95,69.05 TX.4
  Top 0.61: TX.10 TX.8 TX.6 | 65.95,66.6 65.95,69.05 | TX.4 TX.2
  Bottom 0.406: 65.9,71.64 TX.2
  Bottom 0.61: U1.D1 55.12,74.38 56,73.5 64.8,73.5 65.9,72.4 65.9,71.64
VIN
  Bottom 1.27: 39.9,26.95 U1.VIN
  Bottom 1.422: JP4.1 38.58,31.42 39.8,30.2 39.8,27 U1.VIN
  Bottom 1.93: U1.VIN 42.5,24.3 85.6,24.3 88,26.7 88,93 83,98 60.1,98 58.2,96.1 58.2,93 57.15,91.95 JP3.1

### Text on the board
Top: BOARD / IoT UD / V1.0
Bottom: Diseñado por: / Leonardo / Urrego / @trecetp / 2016
tNames: _ | + | NO | 5V | Vin | NC | TX IR | RX IR | RX BT | TX BT | TX BT | RX BT | RX ESP | TX ESP | TX ESP | RX ESP | GND | GPIO2 | VCC | GND | CH_PD | GPIO0 | RST | VCC | X | | | < | | | Y | Z | o | . | < | BOARD / IoT DEV | 5V | Vin | SCL | SDA | 3.3V | GND | i2C | i2C | i2C | 3.3V | GND | SCL | SDA | VCC | SIG | GND | DHT11 | POTENCIOMETRO | LM35 | PULSADOR | FOTOCELDA | SS39ET (A) | SS351AT (D)